# EAGLE design iGlucose (EAGLE 5.10)
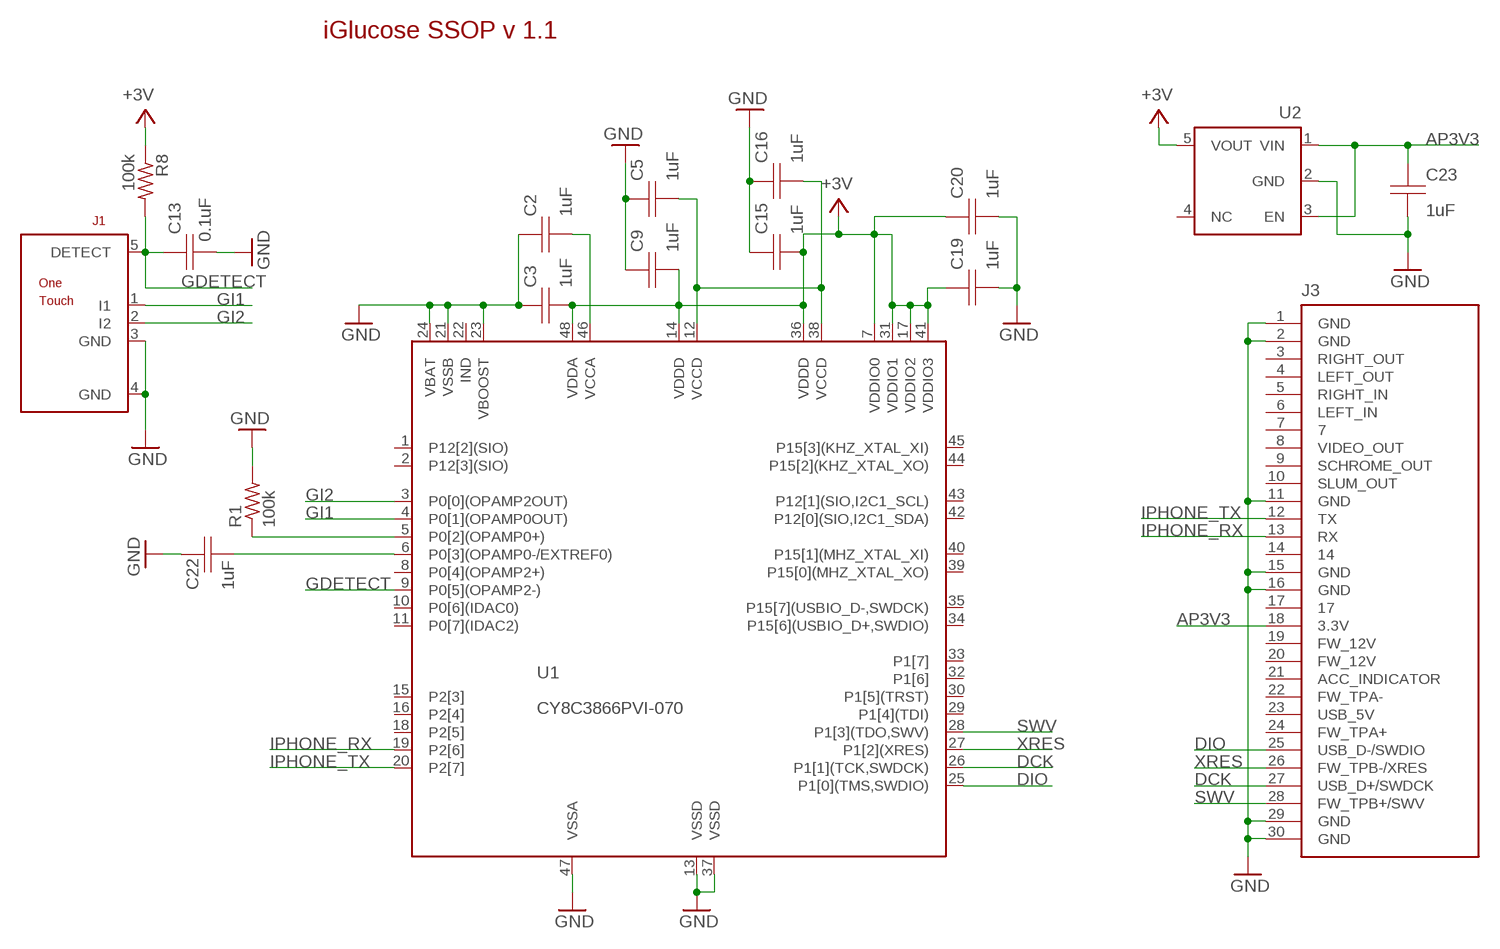
[diagram p0: schematic, sheet 1]

## Parts
C2  1uF  CAPACITOR0402  [0402]
C3  1uF  CAPACITOR0402  [0402]
C5  1uF  CAPACITOR0402  [0402]
C9  1uF  CAPACITOR0402  [0402]
C13  0.1uF  CAPACITOR0402  [0402]
C15  1uF  CAPACITOR0402  [0402]
C16  1uF  CAPACITOR0402  [0402]
C19  1uF  CAPACITOR0402  [0402]
C20  1uF  CAPACITOR0402  [0402]
C22  1uF  CAPACITOR0402  [0402]
C23  1uF  CAPACITOR0402  [0402]
J1  ONE_TOUCH_NH  [ONE_TOUCH_NH]
J3  IPOD_CONNECTOR_MALE_4  [IPOD_CONNECTOR_MALE_4]
R1  100k  R-US_R0603  [R0603]
R8  100k  R-US_R0603  [R0603]
U1  CY8C3866PVI-070  CY8C3866PVI  [SSOP48]
U2  ADP151AUJZ  [TSOT5]

## Nets
+3V3 [Power]: C3.1 C9.1 C15.1 C19.2 C20.2 R8.1 U1.7(VDDIO0) U1.14(VDDD) U1.17(VDDIO2) U1.31(VDDIO1) U1.36(VDDD) U1.41(VDDIO3) U1.48(VDDA) U2.5(VOUT) ; supply symbol labelled +3V
AP3V3: C23.2 J3.18(3.3V) U2.1(VIN) U2.3(EN)
DCK: J3.27(USB_D+/SWDCK) U1.26(P1[1](TCK,SWDCK))
DIO: J3.25(USB_D-/SWDIO) U1.25(P1[0](TMS,SWDIO))
GDETECT: C13.2 J1.5(DETECT) R8.2 U1.9(P0[5](OPAMP2-))
GI1: J1.1(I1) U1.4(P0[1](OPAMP0OUT))
GI2: J1.2(I2) U1.3(P0[0](OPAMP2OUT))
GND [Power]: C2.2 C3.2 C5.2 C9.2 C13.1 C15.2 C16.2 C19.1 C20.1 C22.2 C23.1 J1.3(GND) J1.4(GND) J3.1(GND) J3.2(GND) J3.11(GND) J3.15(GND) J3.16(GND) J3.29(GND) J3.30(GND) R1.2 U1.13(VSSD) U1.21(VSSB) U1.23(VBOOST) U1.24(VBAT) U1.37(VSSD) U1.47(VSSA) U2.2(GND)
IPHONE_RX: J3.13(RX) U1.19(P2[6])
IPHONE_TX: J3.12(TX) U1.20(P2[7])
N$3: R1.1 U1.5(P0[2](OPAMP0+))
N$6: C5.1 C16.1 U1.12(VCCD) U1.38(VCCD)
N$9 [Power]: C22.1 U1.6(P0[3](OPAMP0-/EXTREF0))
N$30 [Power]: C2.1 U1.46(VCCA)
SWV: J3.28(FW_TPB+/SWV) U1.28(P1[3](TDO,SWV))
XRES: J3.26(FW_TPB-/XRES) U1.27(P1[2](XRES))
Unconnected: J3.3(RIGHT_OUT) J3.4(LEFT_OUT) J3.5(RIGHT_IN) J3.6(LEFT_IN) J3.7 J3.8(VIDEO_OUT) J3.9(SCHROME_OUT) J3.10(SLUM_OUT) J3.14 J3.17 J3.19(FW_12V) J3.20(FW_12V) J3.21(ACC_INDICATOR) J3.22(FW_TPA-) J3.23(USB_5V) J3.24(FW_TPA+) U1.1(P12[2](SIO)) U1.2(P12[3](SIO)) U1.8(P0[4](OPAMP2+)) U1.10(P0[6](IDAC0)) U1.11(P0[7](IDAC2)) U1.15(P2[3]) U1.16(P2[4]) U1.18(P2[5]) U1.29(P1[4](TDI)) U1.30(P1[5](TRST)) U1.32(P1[6]) U1.33(P1[7]) U1.34(P15[6](USBIO_D+,SWDIO)) U1.35(P15[7](USBIO_D-,SWDCK)) U1.39(P15[0](MHZ_XTAL_XO)) U1.40(P15[1](MHZ_XTAL_XI)) U1.42(P12[0](SIO,I2C1_SDA)) U1.43(P12[1](SIO,I2C1_SCL)) U1.44(P15[2](KHZ_XTAL_XO)) U1.45(P15[3](KHZ_XTAL_XI)) U2.4(NC)

## Notes on the sheet
- iGlucose SSOP v 1.1

## Power pins joined to a net without a drawn wire
IND: U1.22(IND)

## Library data of the parts
C2 C3 C5 C9 C13 C15 C16 C19 C20 C22 C23 = PSoC:CAPACITOR
J1 = PSoC:ONE_TOUCH
J3 = PSoC:IPOD_CONNECTOR
R1 R8 = rcl:R-US_: RESISTOR, American symbol
U1 = PSoC:CY8C3866PVI: http://www.cypress.com/?docID=23490
U2 = PSoC:ADP151: http://www.analog.com/static/imported-files/data_sheets/ADP151.pdf

## Net classes
0 default: width 0.203 mm, clearance 0.203 mm
1 Power: width 0.203 mm, clearance 0.203 mm

## Board
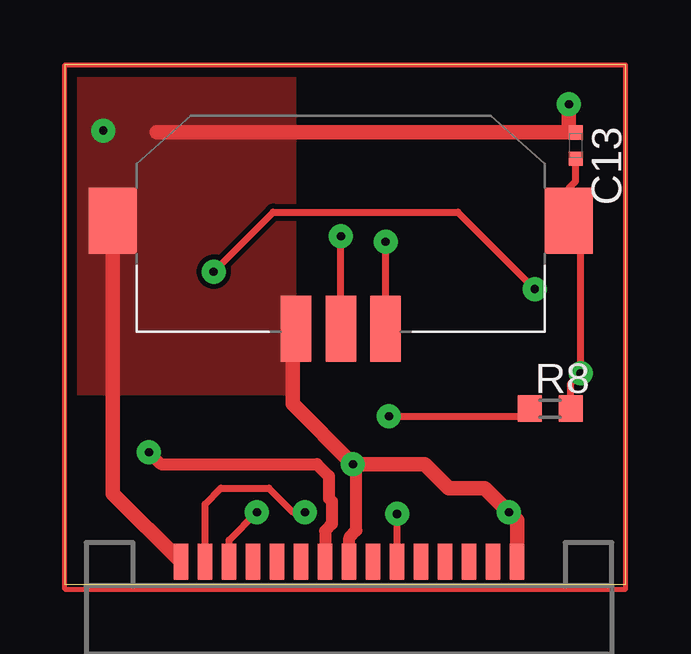
[diagram p1: board, top side]
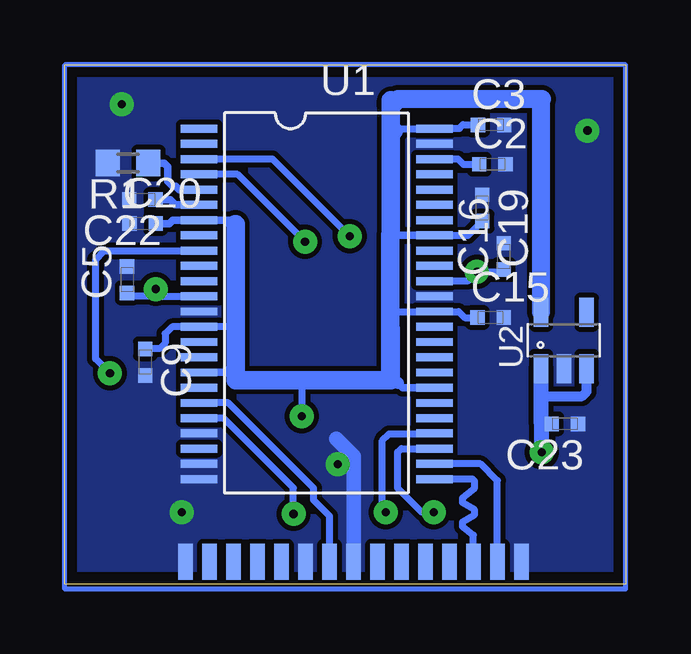
[diagram p2: board, bottom side, seen from below]

Size 23.37 x 21.64 mm. Coordinates in mm from the lower left corner, seen from the top.
Outline: 0,0 23.37,0 23.37,21.64 0,21.64 0,0
Copper layers (1*16): Top 0.035mm / dielectric 1.5mm / Bottom 0.035mm
Design rules "default *": minimum track width 8mil, minimum drill 20mil, track to track 8mil, track to pad 8mil, pad to pad 8mil, via to via 8mil, smd to smd 8mil, copper to edge 20mil, drill to drill 8mil, minimum pad ring 10mil, minimum via ring 8mil, stop-mask expansion 4mil, vias tented up to drill 0mil, thermal gap 10mil

### Footprints (pad centres in the part's own frame; a part is rotated, then mirrored left to right if it is on the bottom)
0402 = smd 0.6 x 0.6: 1 -0.55,0; 2 0.55,0
ONE_TOUCH_NH = smd 1.27 x 2.75: 1 -1.865,-0.045; 2 0,-0.045; 3 1.865,-0.045 | smd 2 x 2.75: 4 9.5,-4.545; 5 -9.5,-4.545
IPOD_CONNECTOR_MALE_4 = smd 0.6 x 1.5 bottom: 1 -6.5,0; 3 -5.5,0; 5 -4.5,0; 7 -3.5,0; 9 -2.5,0; 11 -1.5,0; 13 -0.5,0; 15 0.5,0; 17 1.5,0; 19 2.5,0; 21 3.5,0; 23 4.5,0; 25 5.5,0; 27 6.5,0; 29 7.5,0 | smd 0.6 x 1.5: 2 -7,0; 4 -6,0; 6 -5,0; 8 -4,0; 10 -3,0; 12 -2,0; 14 -1,0; 16 0,0; 18 1,0; 20 2,0; 22 3,0; 24 4,0; 26 5,0; 28 6,0; 30 7,0
R0603 = smd 1 x 1.1: 1 -0.85,0; 2 0.85,0
SSOP48 = smd 0.33 x 1.524: 1 -6.985,-4.445; 2 -6.35,-4.445; 3 -5.715,-4.445; 4 -5.08,-4.445; 5 -4.445,-4.445; 6 -3.81,-4.445; 7 -3.175,-4.445; 8 -2.54,-4.445; 9 -1.905,-4.445; 10 -1.27,-4.445; 11 -0.635,-4.445; 12 0,-4.445; 13 0.635,-4.445; 14 1.27,-4.445; 15 1.905,-4.445; 16 2.54,-4.445; 17 3.175,-4.445; 18 3.81,-4.445; 19 4.445,-4.445; 20 5.08,-4.445; 21 5.715,-4.445; 22 6.35,-4.445; 23 6.985,-4.445; 24 7.62,-4.445; 25 7.62,5.359; 26 6.985,5.359; 27 6.35,5.359; 28 5.715,5.359; 29 5.08,5.359; 30 4.445,5.359; 31 3.81,5.359; 32 3.175,5.359; 33 2.54,5.359; 34 1.905,5.359; 35 1.27,5.359; 36 0.635,5.359; 37 0,5.359; 38 -0.635,5.359; 39 -1.27,5.359; 40 -1.905,5.359; 41 -2.54,5.359; 42 -3.175,5.359; 43 -3.81,5.359; 44 -4.445,5.359; 45 -5.08,5.359; 46 -5.715,5.359; 47 -6.35,5.359; 48 -6.985,5.359
TSOT5 = smd 0.6 x 1.2: 1 -0.95,-1.27; 2 0,-1.27; 3 0.95,-1.27; 4 0.95,1.08; 5 -0.95,1.08

### Placement (x,y rotation side)
C2  5.55,17.5 0 bottom
C3  5.61,19.14 0 bottom
C5  20.77,12.69 90 bottom
C9  20.02,9.25 270 bottom
C13  21.29,18.28 270 top
C15  5.63,11.12 0 bottom
C16  5.08,13.66 90 bottom
C19  5.98,15.68 270 bottom
C20  20.13,15.03 0 bottom
C22  20.14,16.03 180 bottom
C23  2.53,6.68 180 bottom
J1  11.5,10.6 180 top
J3  11.84,0.93 180 top
R1  20.74,17.55 180 bottom
R8  20.22,7.32 0 top
U1  13.33,12 270 bottom
U2  2.58,10.25 0 bottom

### Tracks (layer width: path | path; a pad name or v marks a point on that pad's centre or on a via)
+3V3  (via drill 0.35 pad 1)
  Top 0.3: R8.1 19.05,7 v13.5,7
  Bottom 0.3: U1.41 6.57,14.54 C19.2 | 13.5,8.5 v13.5,7 | U1.14 | U1.14 18.9,10.73 19.19,10.44 19.19,10.05 19.42,9.82 20,9.82 C9.1 | 7.96,19 6.93,19 6.78,19.15 C3.1 | 9.64,11.36 U1.36 6.96,11.36 6.71,11.11 C15.1 | 16.54,10.73 U1.14 | 9.57,18.98 U1.48
  Bottom 0.305: 16.25,10.44 16.54,10.73 | U1.31 7.96,8.18 9.29,8.18 9.5,8.38 | 16.18,9.45 16.25,9.37 16.25,9.24 16.69,8.81 16.7,8.82 U1.17 | 9.8,14.55 9.79,14.54 U1.41 7.96,14.53 | 9.8,11.2 9.64,11.36 | C20.2 19.01,15.03 18.86,15.17 U1.7 16.44,15.17 16.27,15 | 9.66,18.89 9.57,18.98 | 7.96,19 U1.48 | U1.14 17.79,10.72
  Bottom 0.508: 9.8,8.69 9.5,8.38
  Bottom 0.76: U2.5 3.53,20.16 3.48,20.21 9.48,20.21 9.79,19.9
  Bottom 0.762: 9.8,14.55 9.8,13 | 9.8,8.69 9.8,11.2 9.8,13 | 9.79,18.76 9.79,14.54 | 9.79,18.76 9.66,18.89 | 16.27,15 16.25,14.99 16.25,10.44 16.25,9.37 16.25,8.5 13.5,8.5 9.8,8.5 9.8,13 | 9.79,18.76 9.79,19.9 9.79,20.16
AP3V3  (via drill 0.35 pad 1)
  Top 0.5: v3.5,5.5 4,5 10.5,5 11,4.5 11,3.58 11.13,3.45 11.13,2.51 10.84,2.22 J3.18
  Bottom 0.3: 3.39,6.68 C23.2 | 3.5,6.57 3.39,6.68 | 3.39,6.68 3.44,6.68 3.53,6.76
  Bottom 0.406: U2.3 1.63,8.03 1.82,7.84 3.53,7.84
  Bottom 0.635: U2.1 3.53,7.84 3.53,6.76 | v3.5,5.5 3.5,6.57
DCK
  Bottom 0.3: U1.26 6.04,5.01 5.35,4.32 J3.27
DIO
  Bottom 0.3: U1.25 6.38,4.38 6.3,4.3 6.3,4 6.8,3.6 6.8,3.4 6.3,3.1 6.3,2.9 6.8,2.6 6.8,2.4 6.35,2.05 J3.25
GDETECT  (via drill 0.35 pad 1)
  Top 0.3: C13.2 21.29,16.79 21,16.5 J1.5 21.49,14.65 v21.49,8.79 21.07,8.37 R8.2
  Top 0.508: C13.2
  Bottom 0.3: U1.9 21.72,13.9 22.09,13.53 22.09,9.39 v21.49,8.79
GI1  (via drill 0.35 pad 1)
  Top 0.3: J1.1 v13.36,14.27
  Top 0.406: J1.1
  Bottom 0.3: U1.4 16.17,17.08 v13.36,14.27
GI2  (via drill 0.35 pad 1)
  Top 0.3: J1.2 v11.5,14.5
  Bottom 0.3: U1.3 14.71,17.71 v11.5,14.5
GND  (via drill 0.35 pad 1)
  Top 0.5: v12,5 12.15,5 12.15,2.24 11.85,1.94 J3.16
  Top 0.6: 3.83,18.83 C13.1 | v21,20 21,19 | J1.3 9.65,10.63 | J3.30 2,3.77 J1.4 | J3.2 18.84,2.66 v18.5,3 17.5,4 16,4 15,5 v12,5 9.49,7.51 9.49,10.5
  Top 1: 9.49,10.5 J1.3
  Bottom 0.6: J3.15 11.34,5.34 12.05,6.05
  other vias: 1.6,18.9
  pour Bottom (no thermals): -1.5,-0.5 -1.5,22.5 24.5,22.5 24.5,-1 -1.5,-1
  pour Top (no thermals): -1,22 9.5,22 9.5,8 -1,8
IPHONE_RX
  Bottom 0.3: U1.19 16.55,7.55 13,4 13,3.5 12.34,2.84 J3.13
IPHONE_TX  (via drill 0.35 pad 1)
  Top 0.3: J3.12 v13.84,2.93
  Bottom 0.3: U1.20 16.76,6.92 13.85,4.01 v13.85,2.94 v13.84,2.93
N$2
  Top 0.203: 0,-0.2 0,21.64 23.37,21.64 23.37,-0.2 0,-0.2
N$3
  Bottom 0.305: U1.5 18.6,16.44 18.75,16.59 18.87,16.59 19.07,16.79 19.07,17.4 19.23,17.55 R1.1
N$6  (via drill 0.35 pad 1)
  Top 0.3: v6.2,13.02 8.68,15.5 16.38,15.5 v19.58,12.3
  Bottom 0.3: U1.38 6.59,12.63 v6.2,13.02 5.17,13.02 C16.1 | U1.12 19.28,12 v19.58,12.3 19.88,12 20.5,12 20.64,12.14 C5.1
N$9
  Bottom 0.305: U1.6 18.77,15.81 18.98,16.02 19.57,16.02 C22.1
N$10
  Bottom 0.203: 0,-0.2 0,21.64 23.37,21.64 23.37,-0.2 0,-0.2
N$30
  Bottom 0.3: U1.46 6.98,17.71 6.75,17.48 6.12,17.48 C2.1
SWV  (via drill 0.35 pad 1)
  Top 0.3: J3.28 5.84,3.34 6.5,4 8.5,4 9.5,3 v10,3
  Bottom 0.3: U1.28 7.99,6.27 9.86,6.27 10.14,5.99 10.14,3.14 v10,3
XRES  (via drill 0.35 pad 1)
  Top 0.3: J3.26 6.84,1.84 v8,3
  Bottom 0.3: v8,3 8.5,3 9.5,4 9.5,5.5 9.35,5.65 U1.27